# Altium schematic sheet Klotz.SchDoc
size A
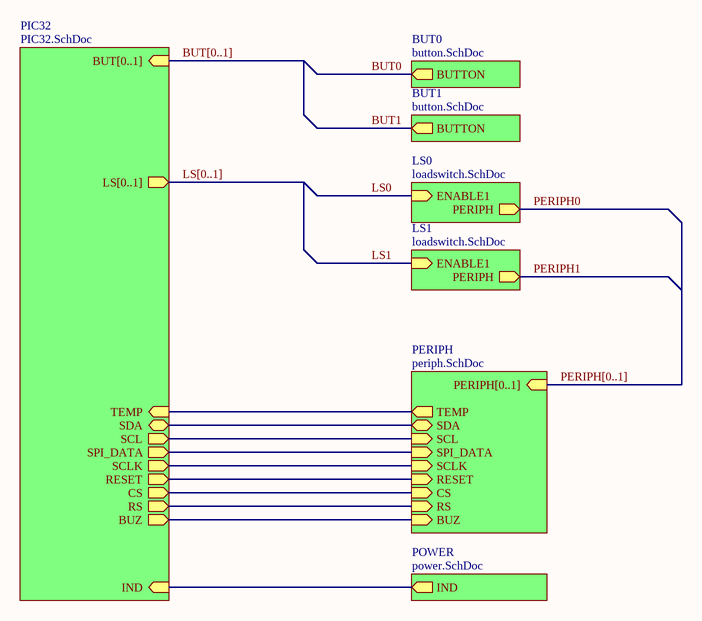
[diagram p0: Klotz.SchDoc]

## Sub-sheets
BUT0 = button.SchDoc: BUTTON (out)
BUT1 = button.SchDoc: BUTTON (out)
LS0 = loadswitch.SchDoc: ENABLE1 (in), PERIPH (out)
LS1 = loadswitch.SchDoc: ENABLE1 (in), PERIPH (out)
PERIPH = periph.SchDoc: PERIPH[0..1] (in), TEMP (out), SDA (bidir), SCL (in), SPI_DATA (in), SCLK (in), RESET (in), CS (in), BUZ (in), RS (in)
PIC32 = PIC32.SchDoc: BUT[0..1] (in), LS[0..1] (out), TEMP (in), SDA (bidir), SCL (out), SCLK (out), BUZ (out), SPI_DATA (out), RESET (out), CS (out), IND (in), RS (out)
POWER = power.SchDoc: IND (out)

## Nets
BUT0: sheet BUT0/BUTTON
BUT1: sheet BUT1/BUTTON
LS0: sheet LS0/ENABLE1
LS1: sheet LS1/ENABLE1
PERIPH0: sheet LS0/PERIPH
PERIPH1: sheet LS1/PERIPH
(unnamed): sheet PIC32/TEMP, sheet PERIPH/TEMP
(unnamed): sheet PIC32/SDA, sheet PERIPH/SDA
(unnamed): sheet PIC32/SCL, sheet PERIPH/SCL
(unnamed): sheet PIC32/SCLK, sheet PERIPH/SCLK
(unnamed): sheet PIC32/BUZ, sheet PERIPH/BUZ
(unnamed): sheet PIC32/SPI_DATA, sheet PERIPH/SPI_DATA
(unnamed): sheet PIC32/RESET, sheet PERIPH/RESET
(unnamed): sheet PIC32/CS, sheet PERIPH/CS
(unnamed): sheet PIC32/IND, sheet POWER/IND
(unnamed): sheet PIC32/RS, sheet PERIPH/RS

## Buses and harness runs
bus BUT[0..1] = sheet PIC32/BUT[0..1]
bus LS[0..1] = sheet PIC32/LS[0..1]
bus PERIPH[0..1] = sheet PERIPH/PERIPH[0..1]